# EAGLE schematic V1.0 (EAGLE 6.1)
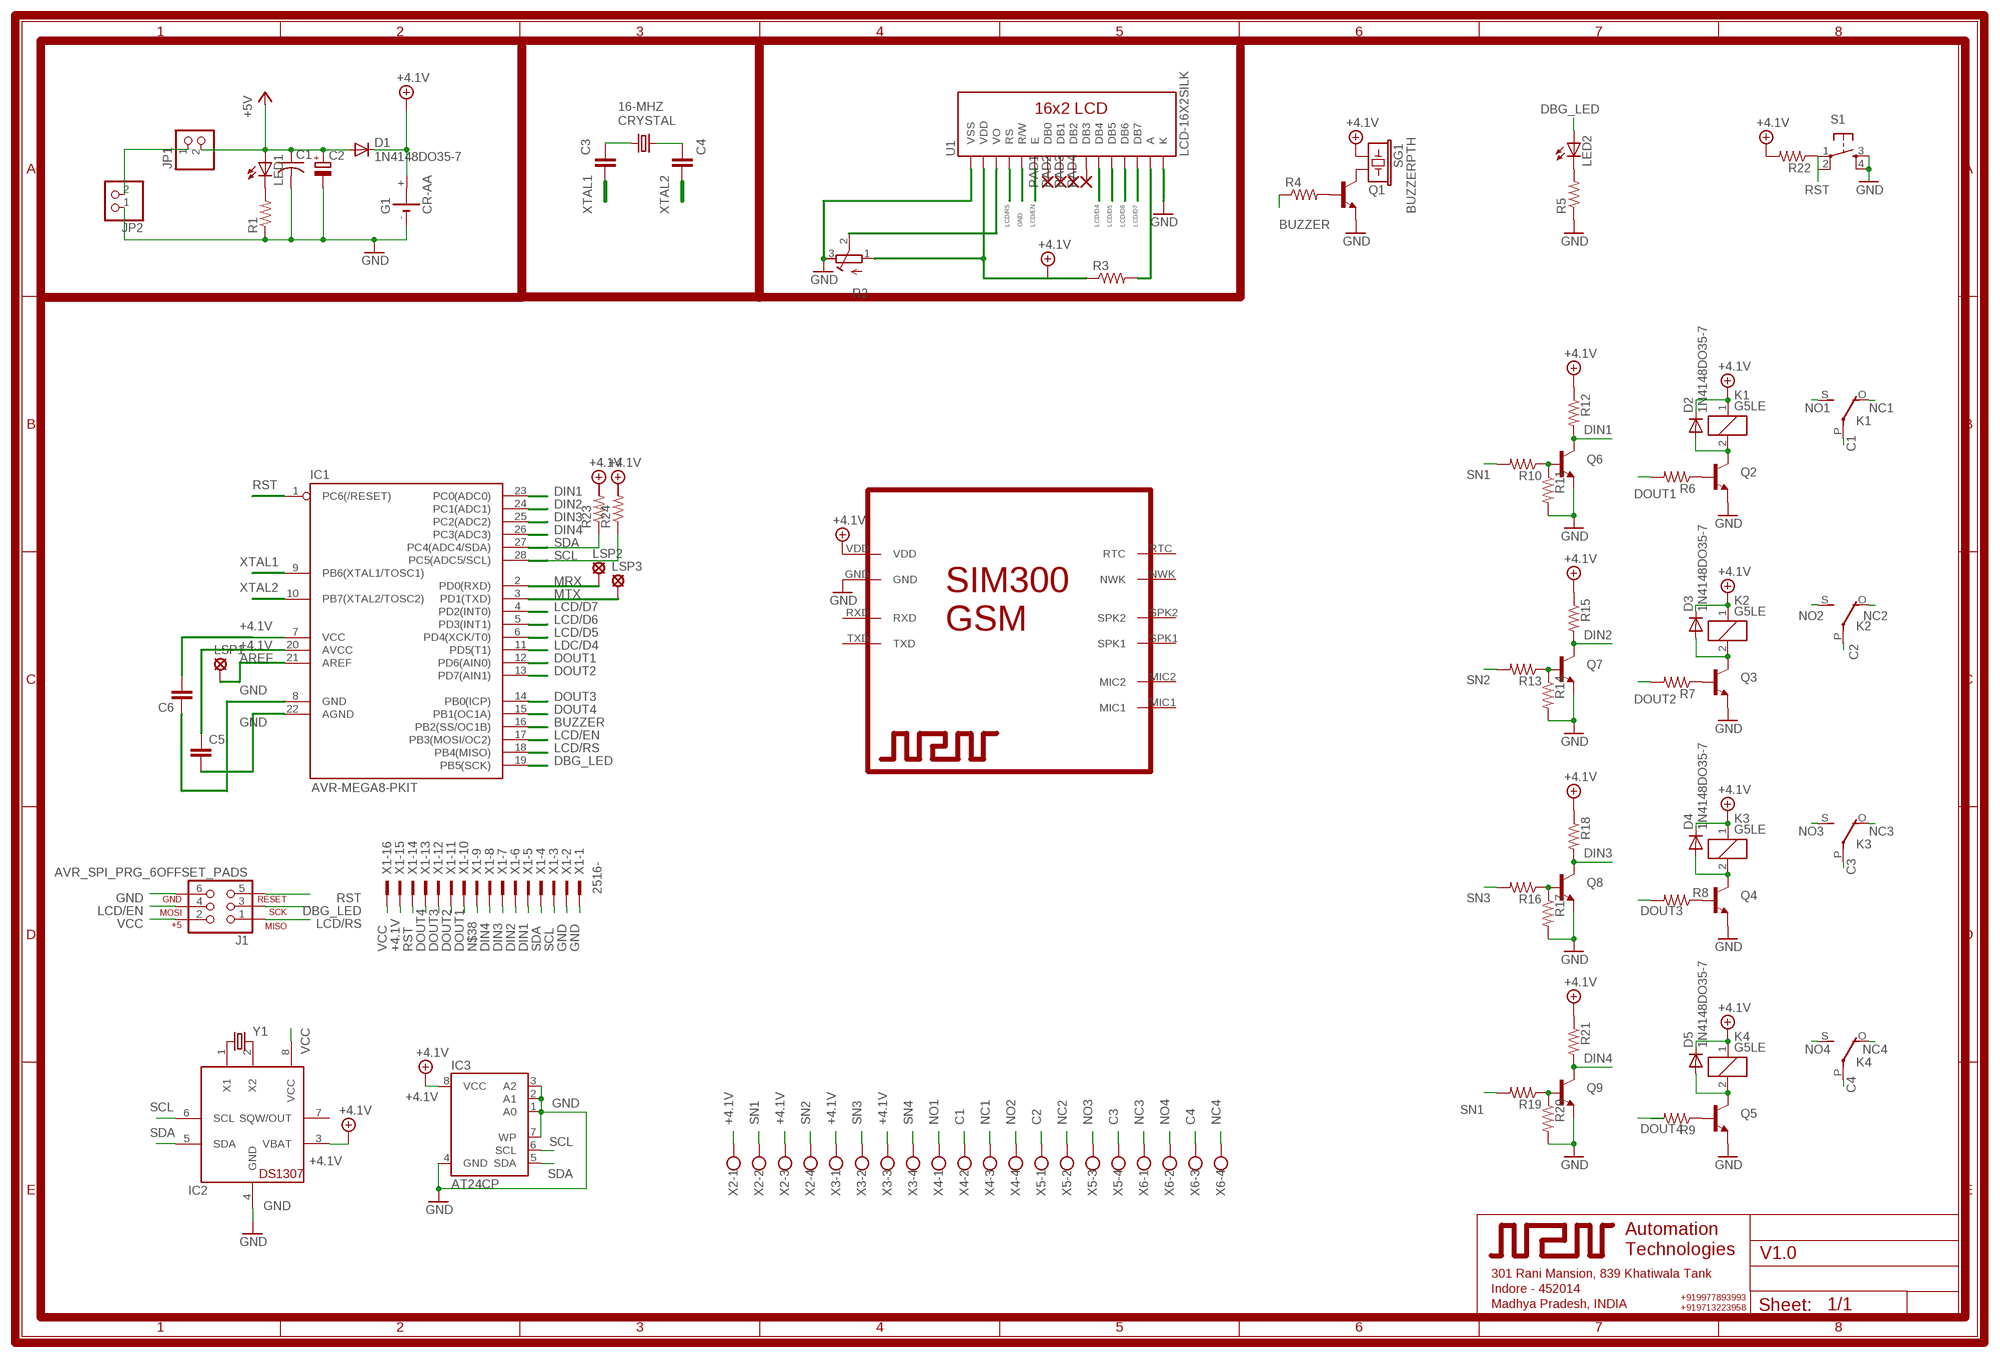
[diagram p0: schematic, sheet 1]

## Parts
C1  C-US050-035X075  [C050-035X075]
C2  CPOL-EUE3.5-8  [E3,5-8]
C3  CAPPTH1  [CAP-PTH-5MM]
C4  CAPPTH1  [CAP-PTH-5MM]
C5  CAPPTH1  [CAP-PTH-5MM]
C6  CAPPTH1  [CAP-PTH-5MM]
CRYSTAL  16-MHZ  CRYSTALHC49UV  [HC49U-V]
D1  1N4148DO35-7  [DO35-7]
D2  1N4148DO35-7  [DO35-7]
D3  1N4148DO35-7  [DO35-7]
D4  1N4148DO35-7  [DO35-7]
D5  1N4148DO35-7  [DO35-7]
G1  CR-AA  [CRAA]
IC1  AVR-MEGA8-PKIT  [DIL28-3-SIMON-KIT]
IC2  DS1307  [DIL08]
IC3  AT24CP  [DIL08]
J1  AVR_SPI_PRG_6OFFSET_PADS  [2X3_OFFSET]
JP1  PINHD-1X2  [1X02]
JP2  PINHD-1X2  [1X02]
K1  G5LE  [G5LE]
K2  G5LE  [G5LE]
K3  G5LE  [G5LE]
K4  G5LE  [G5LE]
LED1  LED5MM  [LED5MM]
LED2  LED5MM  [LED5MM]
LSP1  SE14  [SE14]
LSP2  MCS10B  [MCS10B]
LSP3  MCS10B  [MCS10B]
PAD1  1,6/0,8  [1,6/0,8]
PAD2  1,6/0,8  [1,6/0,8]
PAD3  1,6/0,8  [1,6/0,8]
PAD4  1,6/0,8  [1,6/0,8]
Q1  TRANSISTOR_NPNTO92  [TO-92]
Q2  TRANSISTOR_NPNTO-92-AMMO  [TO-92-AMMO]
Q3  TRANSISTOR_NPNTO-92-AMMO  [TO-92-AMMO]
Q4  TRANSISTOR_NPNTO-92-AMMO  [TO-92-AMMO]
Q5  TRANSISTOR_NPNTO-92-AMMO  [TO-92-AMMO]
Q6  TRANSISTOR_NPNTO-92-AMMO  [TO-92-AMMO]
Q7  TRANSISTOR_NPNTO-92-AMMO  [TO-92-AMMO]
Q8  TRANSISTOR_NPNTO-92-AMMO  [TO-92-AMMO]
Q9  TRANSISTOR_NPNTO-92-AMMO  [TO-92-AMMO]
R1  R-US_0207/10  [0207/10]
R2  R-TRIMM3339P  [RTRIM3339P]
R3  RESISTORPTH-1/2W  [AXIAL-0.5]
R4  RESISTORPTH-1/4W  [AXIAL-0.4]
R5  RESISTORPTH-1/4W  [AXIAL-0.4]
R6  RESISTORPTH-1/4W  [AXIAL-0.4]
R7  RESISTORPTH-1/4W  [AXIAL-0.4]
R8  RESISTORPTH-1/4W  [AXIAL-0.4]
R9  RESISTORPTH-1/4W  [AXIAL-0.4]
R10  RESISTORPTH-1/4W  [AXIAL-0.4]
R11  RESISTORPTH-1/4W  [AXIAL-0.4]
R12  RESISTORPTH-1/4W  [AXIAL-0.4]
R13  RESISTORPTH-1/4W  [AXIAL-0.4]
R14  RESISTORPTH-1/4W  [AXIAL-0.4]
R15  RESISTORPTH-1/4W  [AXIAL-0.4]
R16  RESISTORPTH-1/4W  [AXIAL-0.4]
R17  RESISTORPTH-1/4W  [AXIAL-0.4]
R18  RESISTORPTH-1/4W  [AXIAL-0.4]
R19  RESISTORPTH-1/4W  [AXIAL-0.4]
R20  RESISTORPTH-1/4W  [AXIAL-0.4]
R21  RESISTORPTH-1/4W  [AXIAL-0.4]
R22  RESISTORPTH-1/4W  [AXIAL-0.4]
R23  R-US_0207/10  [0207/10]
R24  R-US_0207/10  [0207/10]
S1  TAC_SWITCHPTH  [TACTILE-PTH]
SG1  BUZZERPTH  [BUZZER-12MM]
U1  LCD-16X2SILK  [LCD-16X2]
U$1  SIM300  [1X10]
X1  2516-  [PAK100/2500-16]
X2  W237-4  [W237-4]
X3  W237-4  [W237-4]
X4  W237-4  [W237-4]
X5  W237-4  [W237-4]
X6  W237-4  [W237-4]
Y1  CRYSTALTC38H  [TC38H]

## Nets
+4.1V: C5.1 C6.2 D1.C D2.C D3.C D4.C D5.C G1.+ IC1.7(VCC) IC1.20(AVCC) IC2.3(VBAT) IC3.8(VCC) K1.1 K2.1 K3.1 K4.1 R2.1(A) R3.P$1 R12.P$1 R15.P$1 R18.P$1 R21.P$1 R22.P$2 SG1.+ U1.2(VDD) U$1.VDD X1.15 X2.1 X2.3 X3.1 X3.3
+5V: C1.1 C2.+ D1.A JP1.2 LED1.A
AREF: IC1.21(AREF) LSP1.MP
BUZZER: IC1.16(PB2(SS/OC1B)) R4.P$1
C1: K1.P(2:P) X4.2
C2: K2.P(2:P) X5.1
C3: K3.P(2:P) X5.4
C4: K4.P(2:P) X6.3
CRYSTAL: C4.1 CRYSTAL.2
DBG_LED: IC1.19(PB5(SCK)) J1.3 LED2.A
DIN1: IC1.23(PC0(ADC0)) Q6.3(C) R12.P$2 X1.5
DIN2: IC1.24(PC1(ADC1)) Q7.3(C) R15.P$2 X1.6
DIN3: IC1.25(PC2(ADC2)) Q8.3(C) R18.P$2 X1.7
DIN4: IC1.26(PC3(ADC3)) Q9.3(C) R21.P$2 X1.8
DOUT1: IC1.12(PD6(AIN0)) R6.P$2 X1.10
DOUT2: IC1.13(PD7(AIN1)) R7.P$2 X1.11
DOUT3: IC1.14(PB0(ICP)) R8.P$2 X1.12
DOUT4: IC1.15(PB1(OC1A)) X1.13
GND: C1.2 C2.- C5.2 C6.1 G1.- IC1.8(GND) IC1.22(AGND) IC2.4(GND) IC3.1(A0) IC3.2(A1) IC3.3(A2) IC3.4(GND) IC3.7(WP) J1.6 JP2.1 Q1.1(E) Q2.1(E) Q3.1(E) Q4.1(E) Q5.1(E) Q6.1(E) Q7.1(E) Q8.1(E) Q9.1(E) R1.1 R2.3(E) R5.P$1 R11.P$2 R14.P$2 R17.P$2 R20.P$2 S1.3 U1.1(VSS) U1.5(R/W) U1.16(K) U$1.GND X1.1 X1.2
LCD/D4: U1.11(DB4)
LCD/D5: IC1.6(PD4(XCK/T0)) U1.12(DB5)
LCD/D6: IC1.5(PD3(INT1)) U1.13(DB6)
LCD/D7: IC1.4(PD2(INT0)) U1.14(DB7)
LCD/EN: IC1.17(PB3(MOSI/OC2)) J1.4 U1.6(E)
LCD/RS: IC1.18(PB4(MISO)) J1.1 U1.4(RS)
LDC/D4: IC1.11(PD5(T1))
MRX: IC1.2(PD0(RXD)) LSP2.MP
MTX: IC1.3(PD1(TXD)) LSP3.MP
N$1: JP1.1 JP2.2
N$2: LED1.K(C) R1.2
N$3: C3.1 CRYSTAL.1
N$4: PAD1.1(P) U1.7(DB0)
N$5: PAD2.1(P) U1.8(DB1)
N$6: R2.2(S) U1.3(VO)
N$7: Q1.3(C) SG1.-
N$8: Q1.2(B) R4.P$2
N$9: LED2.K(C) R5.P$2
N$10: D2.A K1.2 Q2.3(C)
N$11: Q2.2(B) R6.P$1
N$12: D3.A K2.2 Q3.3(C)
N$13: Q3.2(B) R7.P$1
N$14: R3.P$2 U1.15(A)
N$15: PAD3.1(P) U1.9(DB2)
N$16: PAD4.1(P) U1.10(DB3)
N$17: D4.A K3.2 Q4.3(C)
N$18: Q4.2(B) R8.P$1
N$19: D5.A K4.2 Q5.3(C)
N$20: Q5.2(B) R9.P$1
N$21: Q6.2(B) R10.P$1 R11.P$1
N$25: Q7.2(B) R13.P$1 R14.P$1
N$28: Q8.2(B) R16.P$1 R17.P$1
N$29: IC2.2(X2) Y1.2
N$31: Q9.2(B) R19.P$1 R20.P$1
N$32: IC2.1(X1) Y1.1
N$38: X1.9
NC1: K1.O(2:O) X4.3
NC2: K2.O(2:O) X5.2
NC3: K3.O(2:O) X6.1
NC4: K4.O(2:O) X6.4
NO1: K1.S(2:S) X4.1
NO2: K2.S(2:S) X4.4
NO3: K3.S(2:S) X5.3
NO4: K4.S(2:S) X6.2
RST: IC1.1(PC6(/RESET)) J1.5 R22.P$1 S1.1 S1.2 X1.14
SCL: IC1.28(PC5(ADC5/SCL)) IC2.6(SCL) IC3.6(SCL) R24.1 X1.3
SDA: IC1.27(PC4(ADC4/SDA)) IC2.5(SDA) IC3.5(SDA) R23.1 X1.4
SN1: R10.P$2 R19.P$2 X2.2
SN2: R13.P$2 X2.4
SN3: R16.P$2 X3.2
SN4: X3.4
VCC: IC2.8(VCC) J1.2 X1.16
XTAL1: C3.2 IC1.9(PB6(XTAL1/TOSC1))
XTAL2: C4.2 IC1.10(PB7(XTAL2/TOSC2))
Unconnected: G1.+@1(+) IC2.7(SQW/OUT) R9.P$2 R23.2 R24.2 S1.4 U$1.MIC1 U$1.MIC2 U$1.NWK U$1.RTC U$1.RXD U$1.SPK1 U$1.SPK2 U$1.TXD

## Library data of the parts
C1 = rcl:C-US: CAPACITOR, American symbol
C2 = rcl:CPOL-EU: POLARIZED CAPACITOR, European symbol
C3-C6 = SparkFun_NPN:CAP: Capacitor Standard 0603 ceramic capacitor, and 0.1" leaded capacitor.
CRYSTAL Y1 = SparkFun_NPN:CRYSTAL: Crystals Various standard crystals. Proven footprints. Spark Fun Electronics SKU : COM-00534
D1-D5 = diode:1N4148: DIODE high speed (Philips)
G1 = battery:CR-AA: LI BATTERY Varta CRAA-SLF
IC1 = SparkFun:AVR-MEGA8-P: MICROCONTROLLER 8 Kbytes FLASH 1 kbytes SRAM 512 bytes EEPROM USART 4-channel 10 bit ADC 2-channel 8 bit ADC
IC2 = adafruit:DS1307: DS1307 Real time clock (RTC) with battery backup ability. Talk to it via i2c
IC3 = atmel:AT24C*: 2-wire serial EEPROM; MPN: AT24C1024BW-SH-B; OC_FARNELL: 1362646; OC_NEWARK: 03P2044
J1 = SparkFun:AVR_SPI_PRG_6: AVR ISP 6 Pin This is the reduced ISP connector for AVR programming. Common on Arduino. This footprint will take up less PCB space and can be used with a 10-pin to 6-pin adapter such as SKU: BOB-08508
JP1 JP2 = pinhead:PINHD-1X2: PIN HEADER
K1-K4 = relay:G5LE: RELAY 1 x switch, 10 A/120 V AC, 8 A/30 V DC, Omron; OC_FARNELL: unknown; OC_NEWARK: unknown
LED1 LED2 = led:LED: LED OSRAM: - CHIPLED LG R971, LG N971, LY N971, LG Q971, LY Q971, LO R971, LY R971 LH N974, LH R974 LS Q976, LO Q976, LY Q976 LO Q996 - Hyper CHIPLED LW Q18S LB Q993, LB Q99A, LB R99A - SideLED LS A670, LO A670, LY A670, LG A670, LP A670 LB A673, LV A673, LT A673, LW A673 LH A674 LY A675 LS A676, LA A676, LO A676, LY A676, LW A676 LS A679, LY A679, LG A679 - Hyper Micro SIDELED® LS Y876, LA Y876, LO Y876, LY Y876 LT Y87S - SmartLED LW L88C, LW L88S LB L89C, LB L89S, LG L890 LS L89K, LO L89K, LY L89K LS L896, LA L896, LO L896, LY L896 - TOPLED LS T670, LO T670, LY T670, LG T670, LP T670 LSG T670, LSP T670, LSY T670, LOP T670, LYG T670 LG T671, LOG T671, LSG T671 LB T673, LV T673, LT T673, LW T673 LH T674 LS T676, LA T676, LO T676, LY T676, LB T676, LH T676, LSB T676, LW T676 LB T67C, LV T67C, LT T67C, LS T67K, LO T67K, LY T67K, LW E67C LS E67B, LA E67B, LO E67B, LY E67B, LB E67C, LV E67C, LT E67C LW T67C LS T679, LY T679, LG T679 LS T770, LO T770, LY T770, LG T770, LP T770 LB T773, LV T773, LT T773, LW T773 LH T774 LS E675, LA E675, LY E675, LS T675 LS T776, LA T776, LO T776, LY T776, LB T776 LHGB T686 LT T68C, LB T68C - Hyper Mini TOPLED® LB M676 - Mini TOPLED Santana® LG M470 LS M47K, LO M47K, LY M47K Source: http://www.osram.convergy.de LUXEON: - LUMILED® LXK2-PW12-R00, LXK2-PW12-S00, LXK2-PW14-U00, LXK2-PW14-V00 LXK2-PM12-R00, LXK2-PM12-S00, LXK2-PM14-U00 LXK2-PE12-Q00, LXK2-PE12-R00, LXK2-PE12-S00, LXK2-PE14-T00, LXK2-PE14-U00 LXK2-PB12-K00, LXK2-PB12-L00, LXK2-PB12-M00, LXK2-PB14-N00, LXK2-PB14-P00, LXK2-PB14-Q00 LXK2-PR12-L00, LXK2-PR12-M00, LXK2-PR14-Q00, LXK2-PR14-R00 LXK2-PD12-Q00, LXK2-PD12-R00, LXK2-PD12-S00 LXK2-PH12-R00, LXK2-PH12-S00 LXK2-PL12-P00, LXK2-PL12-Q00, LXK2-PL12-R00 Source: www.luxeon.com KINGBRIGHT: KA-3528ASYC Source: www.kingbright.com
LSP1 = solpad:SE14: SOLDER PAD E1553, drill 1,4mm, distributor Buerklin, 07F820
LSP2 LSP3 = solpad:MCS10B: SOLDER PAD MC S1, distributor Buerklin, 15F505
PAD1-PAD4 = wirepad:1,6/0,8: THROUGH-HOLE PAD
Q1-Q9 = SparkFun_NPN:TRANSISTOR_NPN: Transistor NPN BJT configuration in SOT23 package. MMBT2222 is the common NPN we use. Double check BCE configuration again layout.
R1 R23 R24 = rcl:R-US_: RESISTOR, American symbol
R2 = rcl:R-TRIMM: Trimm resistor
R3-R22 = SparkFun_NPN:RESISTOR: Resistor Basic schematic elements and footprints for 0603, 1206, and PTH resistors.
S1 = SparkFun_NPN:TAC_SWITCH: Momentary Switch Button commonly used for reset or general input. Spark Fun Electronics SKU : COM-00097
SG1 = SparkFun_NPN:BUZZER: Buzzer 12mm Spark Fun Electronics SKU : Comp-Buzzer
U1 = SparkFun_NPN:LCD-16X2
U$1 = NPN:SIM300
X1 = con-3m:2516-: 3M (TM) Pak 100 4-Wall Header Source: 3M; OC_FARNELL: unknown; OC_NEWARK: unknown
X2-X6 = con-wago-500:W237-4: WAGO SCREW CLAMP; OC_FARNELL: unknown; OC_NEWARK: unknown